# Altium schematic sheet 0044_RPL PCH H GPIO OPT.SchDoc
size A2
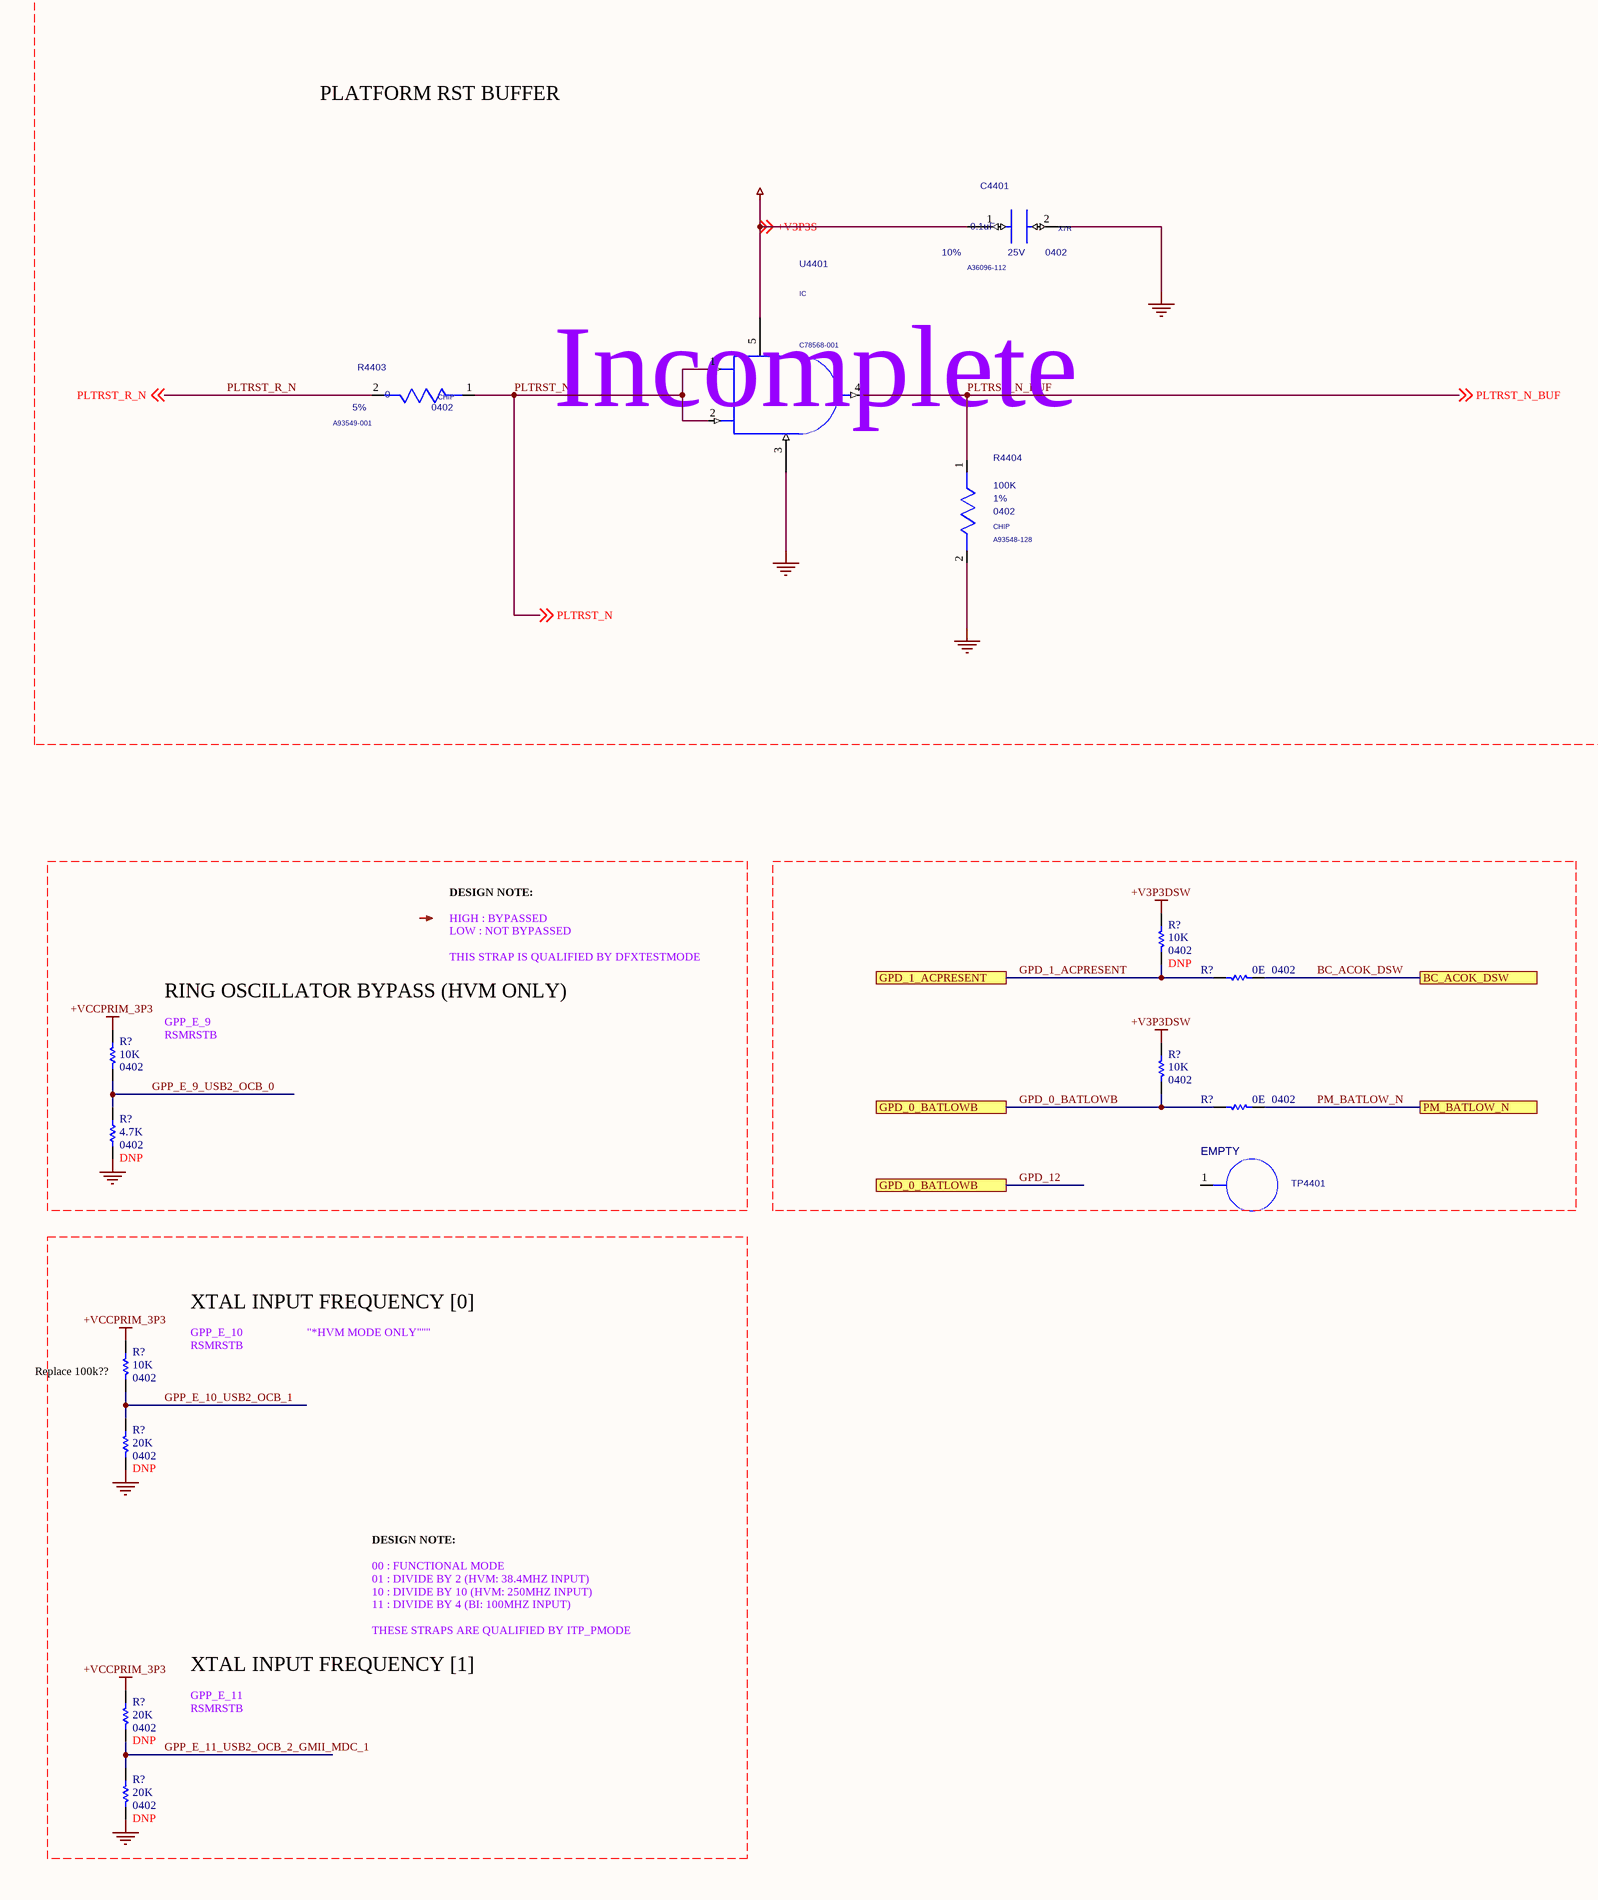
[diagram p0: 0044_RPL PCH H GPIO OPT.SchDoc, left]
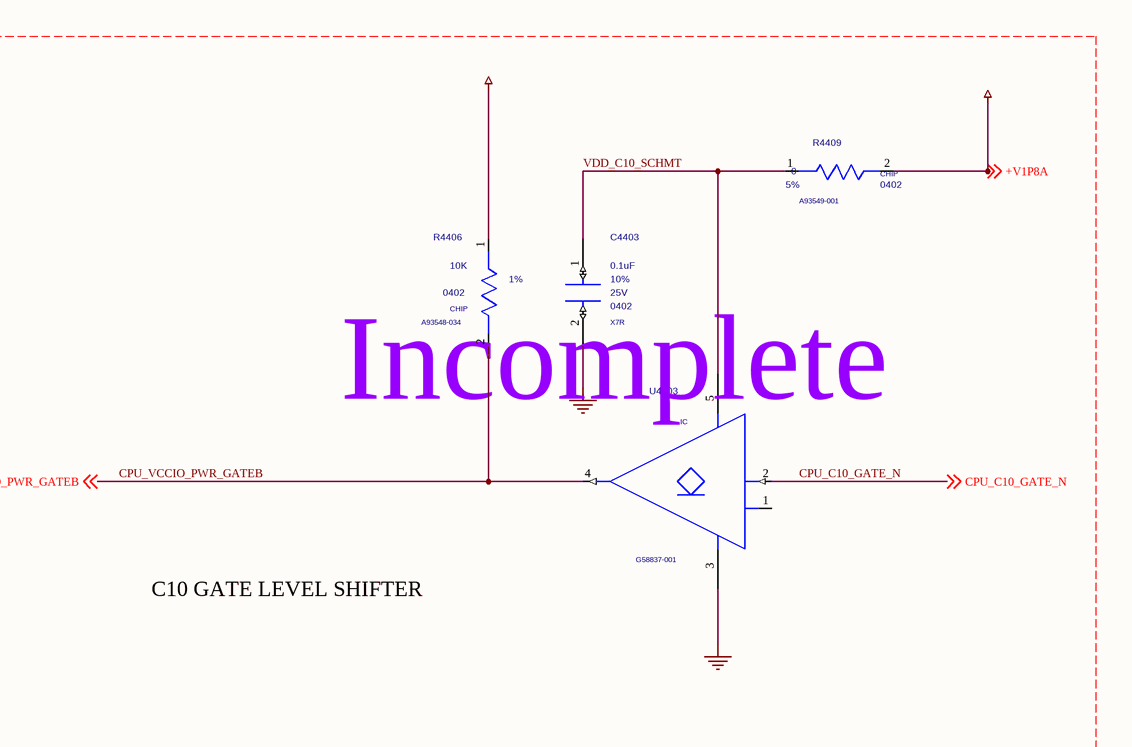
[diagram p1: 0044_RPL PCH H GPIO OPT.SchDoc, right]

## Parts
(Parts that share a designator on the sheet are numbered #1, #2 ... from top to bottom, then left to right.)
C4401  0.1uF  MATERIAL: X7R  PACK_TYPE: 0402  PART_NUMBER: A36096-112  TOLERANCE: 10%  VOLTAGE: 25V  [SMC0402IA]
C4403  0.1uF  MATERIAL: X7R  PACK_TYPE: 0402  TOLERANCE: 10%  VOLTAGE: 25V  [SMC0402IA]
R4403  0  MATERIAL: CHIP  PACK_TYPE: 0402  PART_NUMBER: A93549-001  TOLERANCE: 5%  [SMR0402IA]
R4404  100K  MATERIAL: CHIP  PACK_TYPE: 0402  PART_NUMBER: A93548-128  TOLERANCE: 1%  [SMR0402IA]
R4406  10K  MATERIAL: CHIP  PACK_TYPE: 0402  PART_NUMBER: A93548-034  TOLERANCE: 1%  [SMR0402IA]
R4409  0  MATERIAL: CHIP  PACK_TYPE: 0402  PART_NUMBER: A93549-001  TOLERANCE: 5%  [SMR0402IA]
R?#1  value 10K  Case/Package: 0402  [RESC0402]  (hidden comment: Res)
R?#2  value 0E  Case/Package: 0402  [RESC0402]  (hidden comment: Res)
R?#3  value 10K  Case/Package: 0402  [RESC0402]  (hidden comment: Res)
R?#4  value 10K  Case/Package: 0402  [RESC0402]  (hidden comment: Res)
R?#5  value 0E  Case/Package: 0402  [RESC0402]  (hidden comment: Res)
R?#6  value 4.7K  Case/Package: 0402  [RESC0402]  (hidden comment: Res)
R?#7  value 10K  Case/Package: 0402  [RESC0402]  (hidden comment: Res)
R?#8  value 20K  Case/Package: 0402  [RESC0402]  (hidden comment: Res)
R?#9  value 20K  Case/Package: 0402  [RESC0402]  (hidden comment: Res)
R?#10  value 20K  Case/Package: 0402  [RESC0402]  (hidden comment: Res)
TP4401  MATERIAL: EMPTY  [TPS16]  (hidden comment: TP20)
U4401  MATERIAL: IC  PART_NUMBER: C78568-001  [SOT23_5ME]  (hidden comment: TTL1G08)
U4403  MATERIAL: IC  PART_NUMBER: G58837-001  [TSSOP5_21X13_65MA]  (hidden comment: TTL07)

## Ports
BC_ACOK_DSW, GPD_0_BATLOWB, GPD_1_ACPRESENT, PM_BATLOW_N

## Nets
+V1P8A: R4409.2(B) ; off-sheet +V1P8A
+V3P3A: R4406.1(A)
+V3P3DSW: R?#1.2 R?#4.2
+V3P3S: C4401.1(A) U4401.5(VCC) ; off-sheet +V3P3S
+VCCPRIM_3P3: R?#3.2 R?#7.2 R?#9.2
GND: C4401.2(B) C4403.2(B) R4404.2(B) R?#6.1 R?#8.1 R?#10.1 U4401.3(GND) U4403.3(GND)
BC_ACOK_DSW: R?#2.2 ; port BC_ACOK_DSW
CPU_C10_GATE_N: U4403.2(A) ; off-sheet CPU_C10_GATE_N
CPU_VCCIO_PWR_GATEB: R4406.2(B) U4403.4(Y) ; off-sheet CPU_VCCIO_PWR_GATEB
GPD_0_BATLOWB: R?#4.1 R?#5.1 ; port GPD_0_BATLOWB  [also labelled GPD_12]
GPD_1_ACPRESENT: R?#1.1 R?#2.1 ; port GPD_1_ACPRESENT
GPP_E_9_USB2_OCB_0: R?#3.1 R?#6.2
GPP_E_10_USB2_OCB_1: R?#7.1 R?#8.2
GPP_E_11_USB2_OCB_2_GMII_MDC_1: R?#9.1 R?#10.2
PLTRST_N: R4403.1(A) U4401.1(A) U4401.2(B) ; off-sheet PLTRST_N
PLTRST_N_BUF: R4404.1(A) U4401.4(Y) ; off-sheet PLTRST_N_BUF
PLTRST_R_N: R4403.2(B) ; off-sheet PLTRST_R_N
PM_BATLOW_N: R?#5.2 ; port PM_BATLOW_N
VDD_C10_SCHMT: C4403.1(A) R4409.1(A) U4403.5(VCC)

Not connected (* = marked no-connect by the designer): TP4401 1(TP); U4403 1(NC)

## Notes on the sheet
- PLATFORM RST BUFFER
- Incomplete
- (near U4401) Incomplete
- C10 GATE LEVEL SHIFTER
- DESIGN NOTE:
- LOW : NOT BYPASSED
- HIGH : BYPASSED
- THIS STRAP IS QUALIFIED BY DFXTESTMODE
- GPP_E_9
- RING OSCILLATOR BYPASS (HVM ONLY)
- RSMRSTB
- GPP_E_10
- XTAL INPUT FREQUENCY [0]
- "*HVM MODE ONLY"""
- (near R?#7) Replace 100k??
- 11 : DIVIDE BY 4 (BI: 100MHZ INPUT)
- 10 : DIVIDE BY 10 (HVM: 250MHZ INPUT)
- 01 : DIVIDE BY 2 (HVM: 38.4MHZ INPUT)
- 00 : FUNCTIONAL MODE
- XTAL INPUT FREQUENCY [1]
- THESE STRAPS ARE QUALIFIED BY ITP_PMODE
- GPP_E_11

## Library data of the parts
C4401 = CAP#1: CHIPS_PART_NAME: CAP; CDS_PHYS_PART_NAME: CAP_0402-A36096-112,X7R,0.1UF,25V,10%,LPDB,GENERIC; OriginalSymbolOrigin: (-25,50); XY: (4400,4150); VER: 2; ROT: 0; PHYS_PAGE: 44; LOCATION: C4401; IP: GENERIC; FP_TECH: LPDB; DRAWING: @RVP1_ADL_SB_ADP_S_DDR5_SODIMM_2DPC_LIB.H55_DG2_2DPC(SCH_1):PAGE44; CDS_LIB: discrete; PCB Footprint: SMC0402IA; CDS_PART_NAME: CAP_0402-A36096-112,X7R,0.1UF,25V,10%,LPDB,GENERIC; CDS_LOCATION: C4401; ASI_MODEL: A36096-112
C4403 = CAP: PART_NUMBER: A36096-112; CDS_PHYS_PART_NAME: CAP_0402-A36096-112,X7R,0.1UF,25V,10%,LPDB,GENERIC; OriginalSymbolOrigin: (-50,25); XY: (8175,3775); VER: 1; ROT: 0; PHYS_PAGE: 44; LOCATION: C4403; IP: GENERIC; FP_TECH: LPDB; DRAWING: @RVP1_ADL_SB_ADP_S_DDR5_SODIMM_2DPC_LIB.H55_DG2_2DPC(SCH_1):PAGE44; CDS_LIB: discrete; PCB Footprint: SMC0402IA; CHIPS_PART_NAME: CAP; CDS_PART_NAME: CAP_0402-A36096-112,X7R,0.1UF,25V,10%,LPDB,GENERIC; CDS_LOCATION: C4403; ASI_MODEL: A36096-112
R4403 = RES#1: CHIPS_PART_NAME: RES; CDS_PHYS_PART_NAME: RES_0402-A93549-001,CHIP,0,5%,1/16W,LPDB,GENERIC; WATTAGE: 1/16W; OriginalSymbolOrigin: (-75,25); XY: (3250,3825); VER: 1; ROT: 2; PHYS_PAGE: 44; LOCATION: R4403; IP: GENERIC; FP_TECH: LPDB; FIN: SPI; DRAWING: @RVP1_ADL_SB_ADP_S_DDR5_SODIMM_2DPC_LIB.H55_DG2_2DPC(SCH_1):PAGE44; CDS_LIB: discrete; PCB Footprint: SMR0402IA; CDS_PART_NAME: RES_0402-A93549-001,CHIP,0,5%,1/16W,LPDB,GENERIC; CDS_LOCATION: R4403; ASI_MODEL: A93549-001
R4404 = RES: CDS_PHYS_PART_NAME: RES_0402-A93548-128,CHIP,100K,1%,1/16W,LPDB,GENERIC; WATTAGE: 1/16W; OriginalSymbolOrigin: (-25,75); XY: (4300,3600); VER: 2; ROT: 0; PHYS_PAGE: 44; LOCATION: R4404; IP: GENERIC; FP_TECH: LPDB; DRAWING: @RVP1_ADL_SB_ADP_S_DDR5_SODIMM_2DPC_LIB.H55_DG2_2DPC(SCH_1):PAGE44; CDS_LIB: discrete; PCB Footprint: SMR0402IA; CHIPS_PART_NAME: RES; CDS_PART_NAME: RES_0402-A93548-128,CHIP,100K,1%,1/16W,LPDB,GENERIC; CDS_LOCATION: R4404; ASI_MODEL: A93548-128
R4406 = RES: CDS_PHYS_PART_NAME: RES_0402-A93548-034,CHIP,10K,1%,1/16W,LPDB,GENERIC; WATTAGE: 1/16W; OriginalSymbolOrigin: (-25,75); XY: (8000,3775); VER: 2; ROT: 0; PHYS_PAGE: 44; LOCATION: R4406; IP: GENERIC; FP_TECH: LPDB; DRAWING: @RVP1_ADL_SB_ADP_S_DDR5_SODIMM_2DPC_LIB.H55_DG2_2DPC(SCH_1):PAGE44; CDS_LIB: discrete; PCB Footprint: SMR0402IA; CHIPS_PART_NAME: RES; CDS_PART_NAME: RES_0402-A93548-034,CHIP,10K,1%,1/16W,LPDB,GENERIC; CDS_LOCATION: R4406; ASI_MODEL: A93548-034
R4409 = RES#1: CHIPS_PART_NAME: RES; CDS_PHYS_PART_NAME: RES_0402-A93549-001,CHIP,0,5%,1/16W,LPDB,GENERIC; WATTAGE: 1/16W; OriginalSymbolOrigin: (-75,25); XY: (8650,4000); VER: 1; PHYS_PAGE: 44; LOCATION: R4409; IP: GENERIC; FP_TECH: LPDB; DRAWING: @RVP1_ADL_SB_ADP_S_DDR5_SODIMM_2DPC_LIB.H55_DG2_2DPC(SCH_1):PAGE44; CDS_LIB: discrete; PCB Footprint: SMR0402IA; ROT: 0; CDS_PART_NAME: RES_0402-A93549-001,CHIP,0,5%,1/16W,LPDB,GENERIC; CDS_LOCATION: R4409; ASI_MODEL: A93549-001
R?#1 R?#3 R?#4 R?#7 = Res: Thick Film Resistor -  10Kohm, 1%, 0402
  R?#1: DNP: DNP
R?#2 R?#5 = Res: Thick Film Resistor -  0ohm, 1%, 0402
R?#6 = Res: Thick Film Resistor -  4.7Kohm, 1%, 0402; DNP: DNP
R?#8-R?#10 = Res: Thick Film Resistor -  20Kohm, 1%, 0402; DNP: DNP
TP4401 = TP#1: PART_NUMBER: NA_TPS16; CHIPS_PART_NAME: TP; CDS_PHYS_PART_NAME: TP_SM-NA_TPS16,EMPTY,TPS16,LPDB,GENERIC; CDS_LMAN_SYM_OUTLINE: -50,50,50,-50; PACK_TYPE: SM; OriginalSymbolOrigin: (-50,75); XY: (9525,1325); VER: 3; ROT: 1; PHYS_PAGE: 44; LOCATION: TP4401; IP: GENERIC; FP_TECH: LPDB; DRAWING: @RVP1_ADL_SB_ADP_S_DDR5_SODIMM_2DPC_LIB.H55_DG2_2DPC(SCH_1):PAGE44; CDS_LIB: board_artifacts; PCB Footprint: TPS16; CDS_PART_NAME: TP_SM-NA_TPS16,EMPTY,TPS16,LPDB,GENERIC; CDS_LOCATION: TP4401; ASI_MODEL: NA_TPS16
U4401 = TTL1G08: CDS_PHYS_PART_NAME: TTL1G08_SM-C78568-001,IC,74AHC1G08,LPDB,GENERIC; CDS_LMAN_SYM_OUTLINE: -100,100,100,-100"; PACK_TYPE: SM; OriginalSymbolOrigin: (-125,75); XY: (3950,3825); VER: 1; ROT: 0; PHYS_PAGE: 44; LOCATION: U4401; IP: GENERIC; FP_TECH: LPDB; DRAWING: @RVP1_ADL_SB_ADP_S_DDR5_SODIMM_2DPC_LIB.H55_DG2_2DPC(SCH_1):PAGE44; CDS_LIB: ttl; PCB Footprint: SOT23_5ME; SEC_TYPE: SM; CHIPS_PART_NAME: TTL1G08; CDS_PART_NAME: TTL1G08_SM-C78568-001,IC,74AHC1G08,LPDB,GENERIC; CDS_LOCATION: U4401; ASI_MODEL: C78568-001
U4403 = TTL07: CDS_PHYS_PART_NAME: TTL07_SM-G58837-001,IC,74AUP1G07GW,LPDB,GENERIC; CDS_LMAN_SYM_OUTLINE: -100,150,150,-150"; PACK_TYPE: SM; OriginalSymbolOrigin: (-125,125); XY: (8375,3425); VER: 1; ROT: 2; PHYS_PAGE: 44; LOCATION: U4403; IP: GENERIC; FP_TECH: LPDB; DRAWING: @RVP1_ADL_SB_ADP_S_DDR5_SODIMM_2DPC_LIB.H55_DG2_2DPC(SCH_1):PAGE44; CDS_LIB: ttl; PCB Footprint: TSSOP5_21X13_65MA; CHIPS_PART_NAME: TTL07; CDS_PART_NAME: TTL07_SM-G58837-001,IC,74AUP1G07GW,LPDB,GENERIC; CDS_LOCATION: U4403; ASI_MODEL: G58837-001